# Altium schematic sheet 2-BUCK_3V3_MCU.SchDoc: BUCK 3V3 MCU
size A4; Author: Alexandre Cosneau; CompanyName: Tristar; Organization: Tristar; Address1: Suite J-1270; Address2: 400 Rue Montfort; Address3: H3C4J9, MONTREAL; Address4: QUEBEC, CANADA
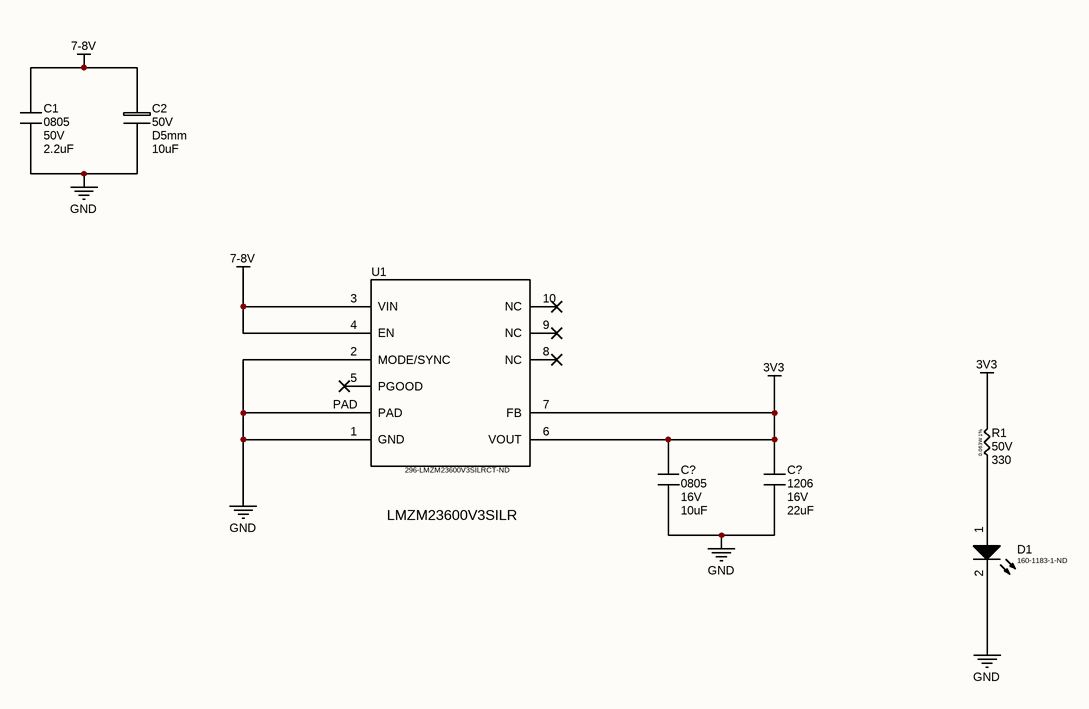
[diagram p0: 2-BUCK_3V3_MCU.SchDoc]

## Parts
(Parts that share a designator on the sheet are numbered #1, #2 ... from top to bottom, then left to right.)
C1  Package: 0805  VDC: 50V  [C 0805(2012)x0.65]  (hidden comment: 2.2uF)
C2  VDC: 50V  Package: D5mm  [EL SMD D5 h5.4]  (hidden comment: 10uF)
C?#1  Package: 0805  VDC: 16V  [C 0805(2012)x0.65]  (hidden comment: 10uF)
C?#2  Package: 1206  VDC: 16V  [C 1206(3216)x1.6]  (hidden comment: 22uF)
D1  Supplier Part Number 1: 160-1183-1-ND  [LED 0603]  (hidden comment: LED 0603)
R1  VDC: 50V  [R 0402(1005)-1%]  (hidden comment: 330)
U1  Supplier Part Number 1: 296-LMZM23600V3SILRCT-ND  [MICROSIP-10]  (hidden comment: MICROSIP)

## Nets
3V3: C?#1.1 C?#2.1 R1.2 U1.6(VOUT) U1.7(FB)
7-8V: C1.1 C2.1 U1.3(VIN) U1.4(EN)
GND: C1.2 C2.2 C?#1.2 C?#2.2 D1.2 U1.1(GND) U1.2(MODE/SYNC) U1.PAD
NetD1_1: D1.1 R1.1

Not connected (* = marked no-connect by the designer): U1 5(PGOOD)* 8(NC)* 9(NC)* 10(NC)*

## Notes on the sheet
- LMZM23600V3SILR
- Title:
- Size:
- Date:
- A
- Revision:
- Time:
- Author:
- Sheet
- of
- File:
- (in symbol RES 0402-1%) 0.063W 1%

## Library data of the parts
C1 C?#1 = CAP 0805 2.2nF 50V X7R: SMD-0805 50V X7R 10%; Part Number: CL21B222KBNC; Manufacturer: Samsung; TYPE: Capacitors; Package-mm: 2012; Mount Type: SMT; Publisher: Hefest; Manufacturer Alternate: *; Part Number Alternate: *; Published: 07.04.2019; Supplier 1: Comet; Supplier 2: *; Supplier 3: *; Supplier Part Number 1: C0805 2.2nF 50V X7R SAMSUNG; Supplier Part Number 2: *; Supplier Part Number 3: *; RoHS: Y; Technology: Ceramic  MLCC; Value 1: *; Value 2: *; TempCo: X7R; Tolerance %: ±10%; VAC: *; ESR Ohm: *; ComponentLink1Description: Datasheet link; ComponentLink1URL: https://store.comet.bg/download-file.php?id=11; Temperature Range: -55°C ~ +125°C; Price: 0.026
  C1: Value: 2.2uF
  C?#1: Value: 10uF
C2 = EL 10uF 50V +105°C: SMD D5mm h5.4mm; Part Number: CK1H100M-CRE54; Manufacturer: Fujicon; Tolerance %: ±20%; TYPE: Capacitors; Load life: 2000h @ +105°C; Mount Type: SMT; Publisher: Hefest; Manufacturer Alternate: *; Part Number Alternate: *; Published: 07.04.2019; Supplier 1: Comet; Supplier 2: *; Supplier 3: *; Supplier Part Number 1: CE 10uF 50V SMD 105C Fujicon; Supplier Part Number 2: *; Supplier Part Number 3: *; RoHS: Y; Technology: Electrolytic Aluminum; Value 1: *; Value 2: *; TempCo: *; VAC: *; ESR Ohm: *; ComponentLink1Description: Datasheet link; ComponentLink1URL: https://store.comet.bg/download-file.php?id=10100; Temperature Range: -40°C ~ +105°C; Price: 0.106; Value: 10uF
C?#2 = CAP 1206 4.7uF 50V X7R: SMD-1206 50V X7R 10%; Part Number: CL31B475KBHNNNE; Manufacturer: Samsung; TYPE: Capacitors; Package-mm: 3216; Mount Type: SMT; Publisher: Hefest; Manufacturer Alternate: *; Part Number Alternate: *; Published: 07.04.2019; Supplier 1: Comet; Supplier 2: *; Supplier 3: *; Supplier Part Number 1: C1206 4.7uF 50V X7R SAMSUNG; Supplier Part Number 2: *; Supplier Part Number 3: *; RoHS: Y; Technology: Ceramic  MLCC; Value 1: *; Value 2: *; TempCo: X7R; Tolerance %: ±10%; VAC: *; ESR Ohm: *; ComponentLink1Description: Datasheet link; ComponentLink1URL: https://store.comet.bg/download-file.php?id=11; Temperature Range: -55°C ~ +125°C; Price: 0.290; Value: 22uF
D1 = LED 0603: LED SMD 0603; Supplier 1: Digi-Key; PACKAGE: 0603; TYPE: LED
R1 = RES 0402-1%: SMD 0402 0.063W 1% 50V; Manufacturer: YAGEO; TempCo: ±100ppm/°C; Package-mm: 1005; Value Code: 1001; Power: 0.0625W; Part Number: *; Mount Type: SMT; Publisher: Hefest; Manufacturer Alternate: *; Published: 07.04.2019; Supplier 1: Comet; Supplier 2: *; Supplier 3: *; Supplier Part Number 1: R0402 1.0K 1% YAG/ASJ; Supplier Part Number 2: *; Supplier Part Number 3: *; RoHS: Y; Technology: Thick film; Value 2: *; Package: 0402; Tolerance %: ±1%; ComponentLink1Description: Datasheet link; ComponentLink1URL: https://store.comet.bg/download-file.php?id=1224; Temperature Range: -55°C ~ +155°C; Price: 0.015; Part Number Alternate: *; TYPE: Resistor; Value 1: *; Value: 330
U1 = LMZM23600: V3 DCDC 3V3 500mA; Supplier 1: Digi-Key; PACKAGE: MICROSIP; TYPE: BUCK